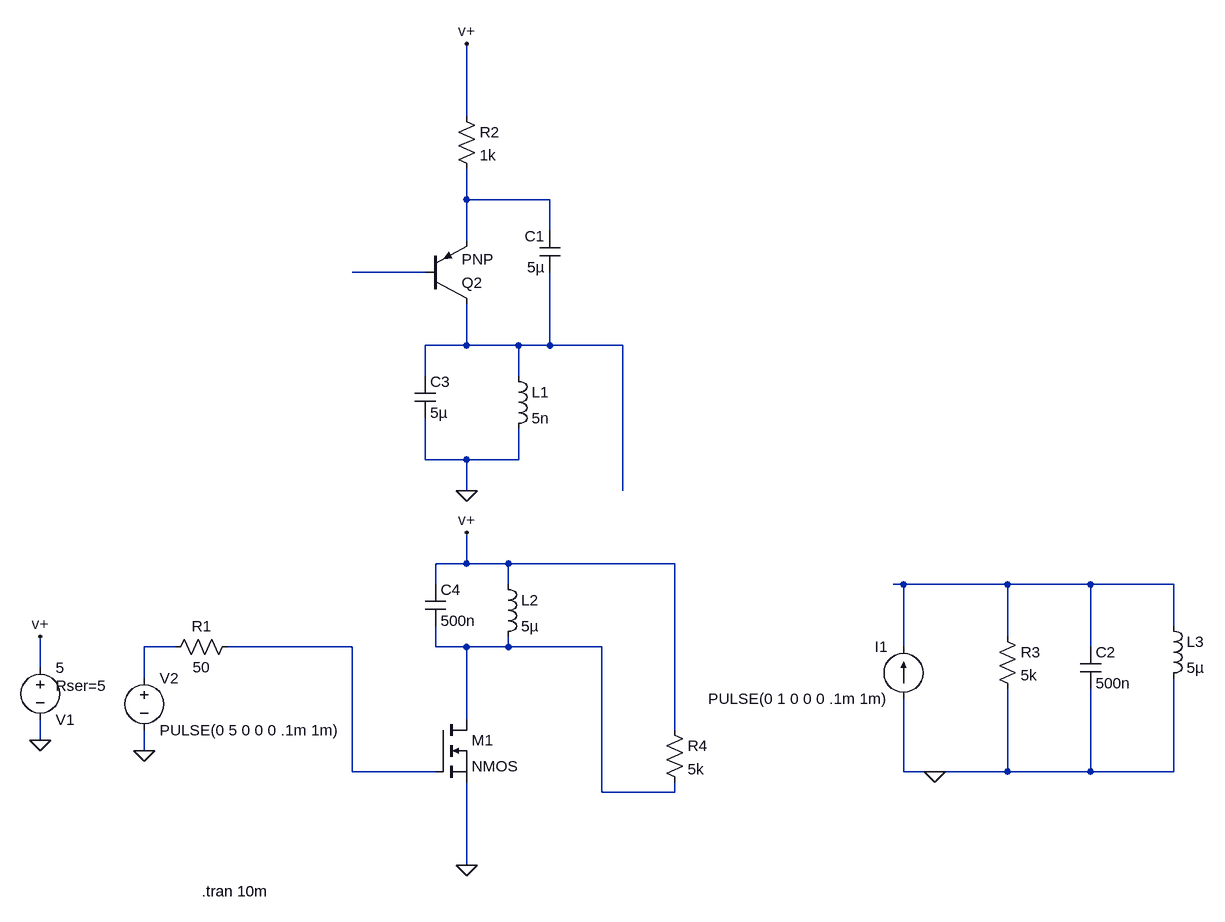
[diagram p0: schematic class-c-amp.asc]
class-c-amp.asc, the LTspice schematic file:
Version 4
SHEET 1 1316 680
WIRE 160 -656 160 -768
WIRE 160 -528 160 -576
WIRE 288 -528 160 -528
WIRE 288 -480 288 -528
WIRE 160 -464 160 -528
WIRE 96 -416 -16 -416
WIRE 160 -304 160 -368
WIRE 160 -304 96 -304
WIRE 240 -304 160 -304
WIRE 288 -304 288 -416
WIRE 288 -304 240 -304
WIRE 400 -304 288 -304
WIRE 96 -256 96 -304
WIRE 240 -256 240 -304
WIRE 96 -128 96 -192
WIRE 160 -128 96 -128
WIRE 240 -128 240 -176
WIRE 240 -128 160 -128
WIRE 160 -80 160 -128
WIRE 400 -80 400 -304
WIRE 160 32 160 -16
WIRE 160 32 112 32
WIRE 224 32 160 32
WIRE 480 32 224 32
WIRE 112 64 112 32
WIRE 224 64 224 32
WIRE 832 64 816 64
WIRE 992 64 832 64
WIRE 1120 64 992 64
WIRE 1248 64 1120 64
WIRE 1248 128 1248 64
WIRE 992 144 992 64
WIRE -288 160 -336 160
WIRE -16 160 -208 160
WIRE 112 160 112 128
WIRE 160 160 112 160
WIRE 224 160 224 144
WIRE 224 160 160 160
WIRE 368 160 224 160
WIRE 832 160 832 64
WIRE 1120 160 1120 64
WIRE -496 192 -496 144
WIRE -336 208 -336 160
WIRE 160 272 160 160
WIRE 480 288 480 32
WIRE -496 304 -496 272
WIRE -336 320 -336 288
WIRE -16 352 -16 160
WIRE 112 352 -16 352
WIRE 832 352 832 240
WIRE 880 352 832 352
WIRE 992 352 992 224
WIRE 992 352 880 352
WIRE 1120 352 1120 224
WIRE 1120 352 992 352
WIRE 1248 352 1248 208
WIRE 1248 352 1120 352
WIRE 368 384 368 160
WIRE 480 384 480 368
WIRE 480 384 368 384
WIRE 160 496 160 368
FLAG -496 304 0
FLAG 160 496 0
FLAG -336 320 0
FLAG -496 144 v+
FLAG 160 -768 v+
FLAG 160 -80 0
FLAG 160 -16 v+
FLAG 880 352 0
SYMBOL voltage -496 176 R0
WINDOW 0 24 96 Left 2
WINDOW 3 24 16 Left 2
WINDOW 123 0 0 Left 0
WINDOW 39 24 44 Left 2
SYMATTR InstName V1
SYMATTR Value 5
SYMATTR SpiceLine Rser=5
SYMBOL voltage -336 192 R0
WINDOW 123 0 0 Left 0
WINDOW 39 0 0 Left 0
SYMATTR InstName V2
SYMATTR Value PULSE(0 5 0 0 0 .1m 1m)
SYMBOL pnp 96 -368 M180
SYMATTR InstName Q2
SYMBOL res 464 272 R0
SYMATTR InstName R4
SYMATTR Value 5k
SYMBOL cap 80 -256 R0
SYMATTR InstName C3
SYMATTR Value 5µ
SYMBOL ind 224 -272 R0
SYMATTR InstName L1
SYMATTR Value 5n
SYMBOL cap 96 64 R0
SYMATTR InstName C4
SYMATTR Value 500n
SYMBOL ind 208 48 R0
SYMATTR InstName L2
SYMATTR Value 5µ
SYMBOL res -192 144 R90
WINDOW 0 0 56 VBottom 2
WINDOW 3 32 56 VTop 2
SYMATTR InstName R1
SYMATTR Value 50
SYMBOL res 144 -672 R0
SYMATTR InstName R2
SYMATTR Value 1k
SYMBOL cap 304 -416 R180
WINDOW 0 24 56 Left 2
WINDOW 3 24 8 Left 2
SYMATTR InstName C1
SYMATTR Value 5µ
SYMBOL nmos 112 272 R0
SYMATTR InstName M1
SYMBOL current 832 240 R180
WINDOW 0 24 80 Left 2
WINDOW 3 24 0 Left 2
WINDOW 123 0 0 Left 0
WINDOW 39 0 0 Left 0
SYMATTR InstName I1
SYMATTR Value PULSE(0 1 0 0 0 .1m 1m)
SYMBOL res 976 128 R0
SYMATTR InstName R3
SYMATTR Value 5k
SYMBOL cap 1104 160 R0
SYMATTR InstName C2
SYMATTR Value 500n
SYMBOL ind 1232 112 R0
SYMATTR InstName L3
SYMATTR Value 5µ
TEXT -248 536 Left 2 !.tran 10m

The netlist it stands for:
* class-c-amp.asc
V1 v+ 0 5 Rser=5
V2 N005 0 PULSE(0 5 0 0 0 .1m 1m)
Q2 N003 N002 N001 0 PNP
R4 v+ N007 5k
C3 N003 0 5µ
L1 N003 0 5n
C4 v+ N007 500n
L2 v+ N007 5µ
R1 N006 N005 50
R2 v+ N001 1k
C1 N003 N001 5µ
M1 N007 N006 0 0 NMOS
I1 0 N004 PULSE(0 1 0 0 0 .1m 1m)
R3 N004 0 5k
C2 N004 0 500n
L3 N004 0 5µ
.model NPN NPN
.model PNP PNP
.lib standard.bjt
.model NMOS NMOS
.model PMOS PMOS
.lib standard.mos
.tran 10m
.backanno
.end